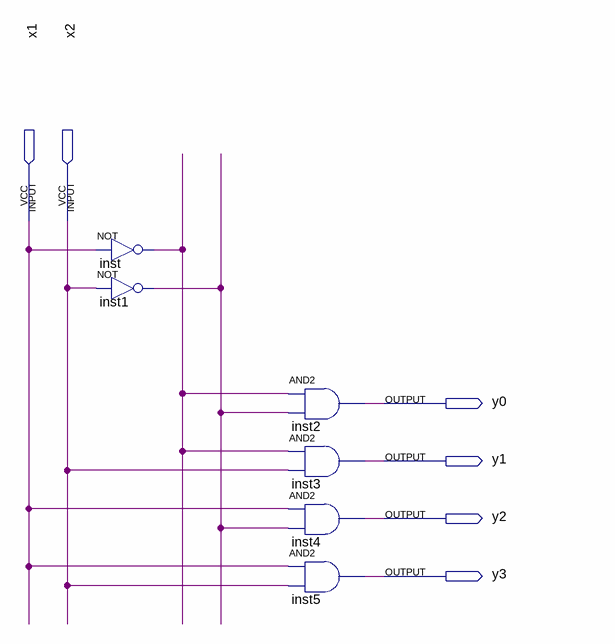
[diagram p0: schematic sheet]
// Quartus schematic scheme1.bdf as structural Verilog: 6 symbols, 6 pins
module scheme1 (
  input  x1,
  input  x2,
  output y0,
  output y1,
  output y2,
  output y3
);

  wire inst1_out, inst_out;

  not inst (inst_out, x1);
  not inst1 (inst1_out, x2);
  and inst2 (y0, inst_out, inst1_out);
  and inst3 (y1, inst_out, x2);
  and inst4 (y2, x1, inst1_out);
  and inst5 (y3, x1, x2);
endmodule
